# Altium schematic sheet Revisions.SchDoc
size A4; SheetNumber: 2; SheetTotal: 5
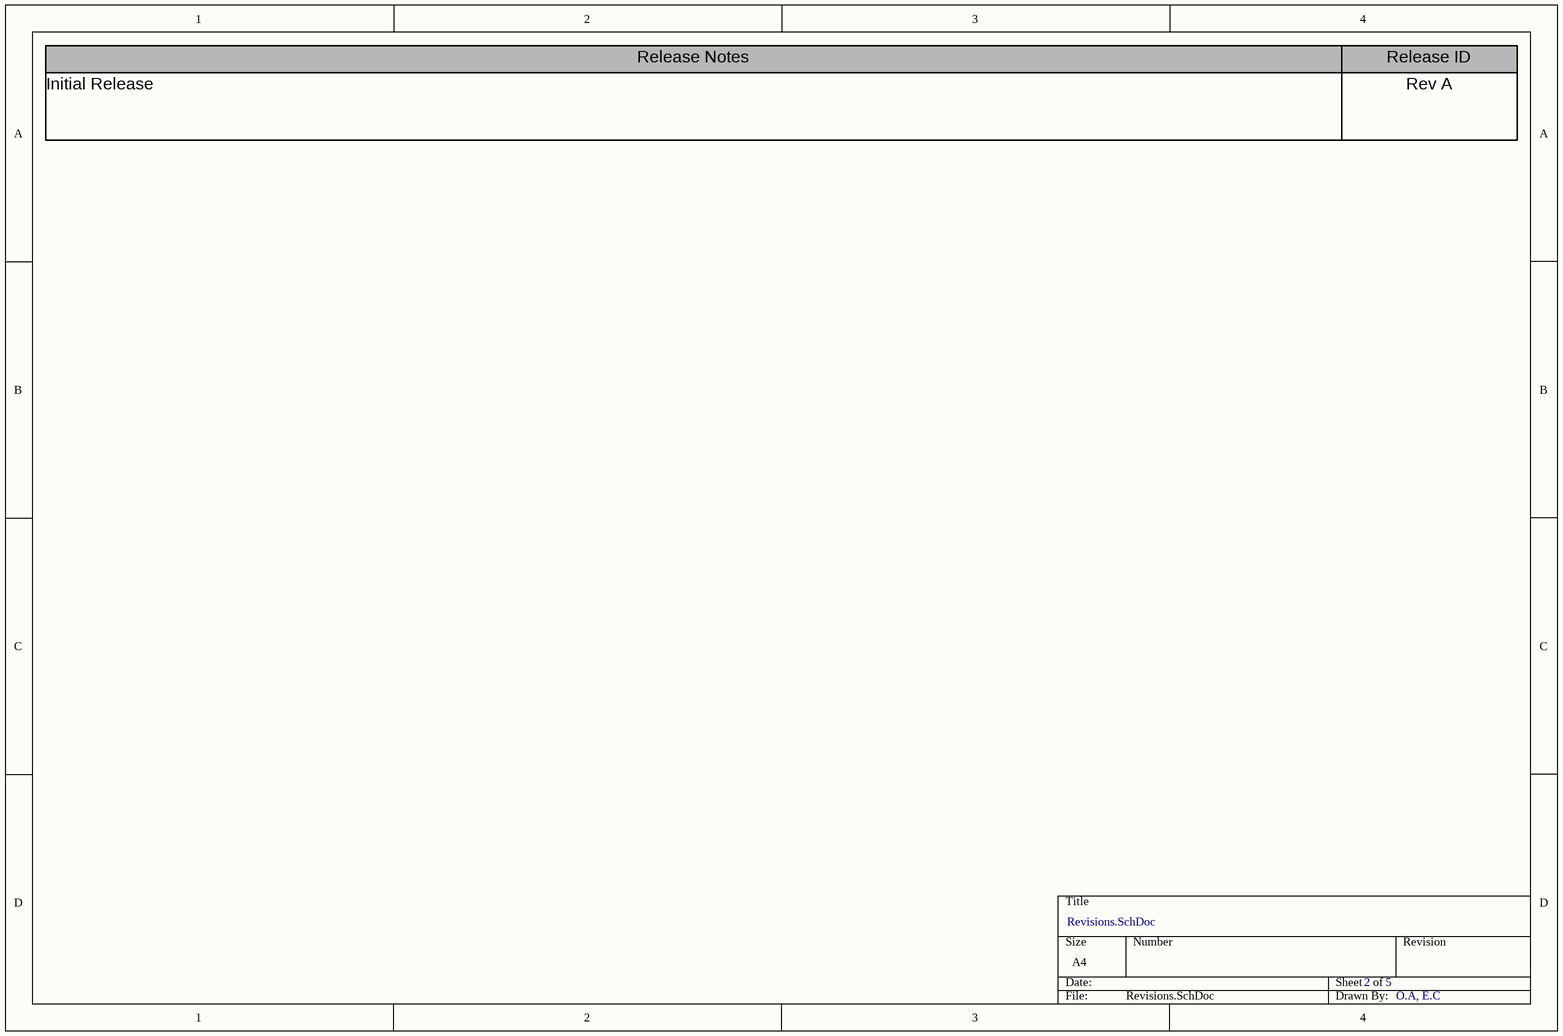
[diagram p0: Revisions.SchDoc]

## Notes on the sheet
- Release Notes
- Release ID
- Initial Release
- Rev A
- O.A, E.C